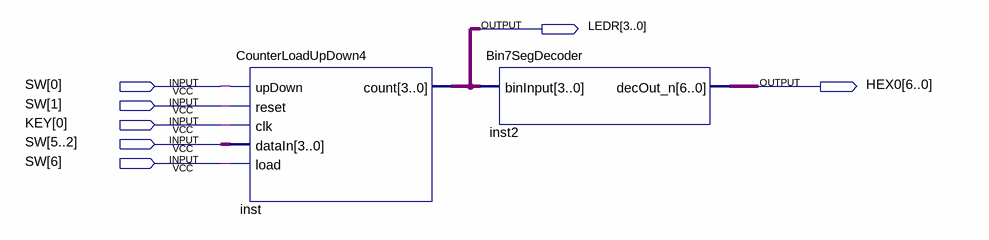
[diagram p0: schematic sheet]
// Quartus schematic Counter_Demo.bdf as structural Verilog: 2 symbols, 7 pins
module Counter_Demo (
  input  [6:0] SW,
  input  [0:0] KEY,
  output [3:0] LEDR,
  output [6:0] HEX0
);

  CounterLoadUpDown4 inst (.upDown(SW[0]), .reset(SW[1]), .clk(KEY[0]), .dataIn(SW[5:2]), .load(SW[6]), .count(LEDR));
  Bin7SegDecoder inst2 (.binInput(LEDR), .decOut_n(HEX0));
endmodule
